# Altium schematic sheet 02 - MCU.SchDoc
size A3
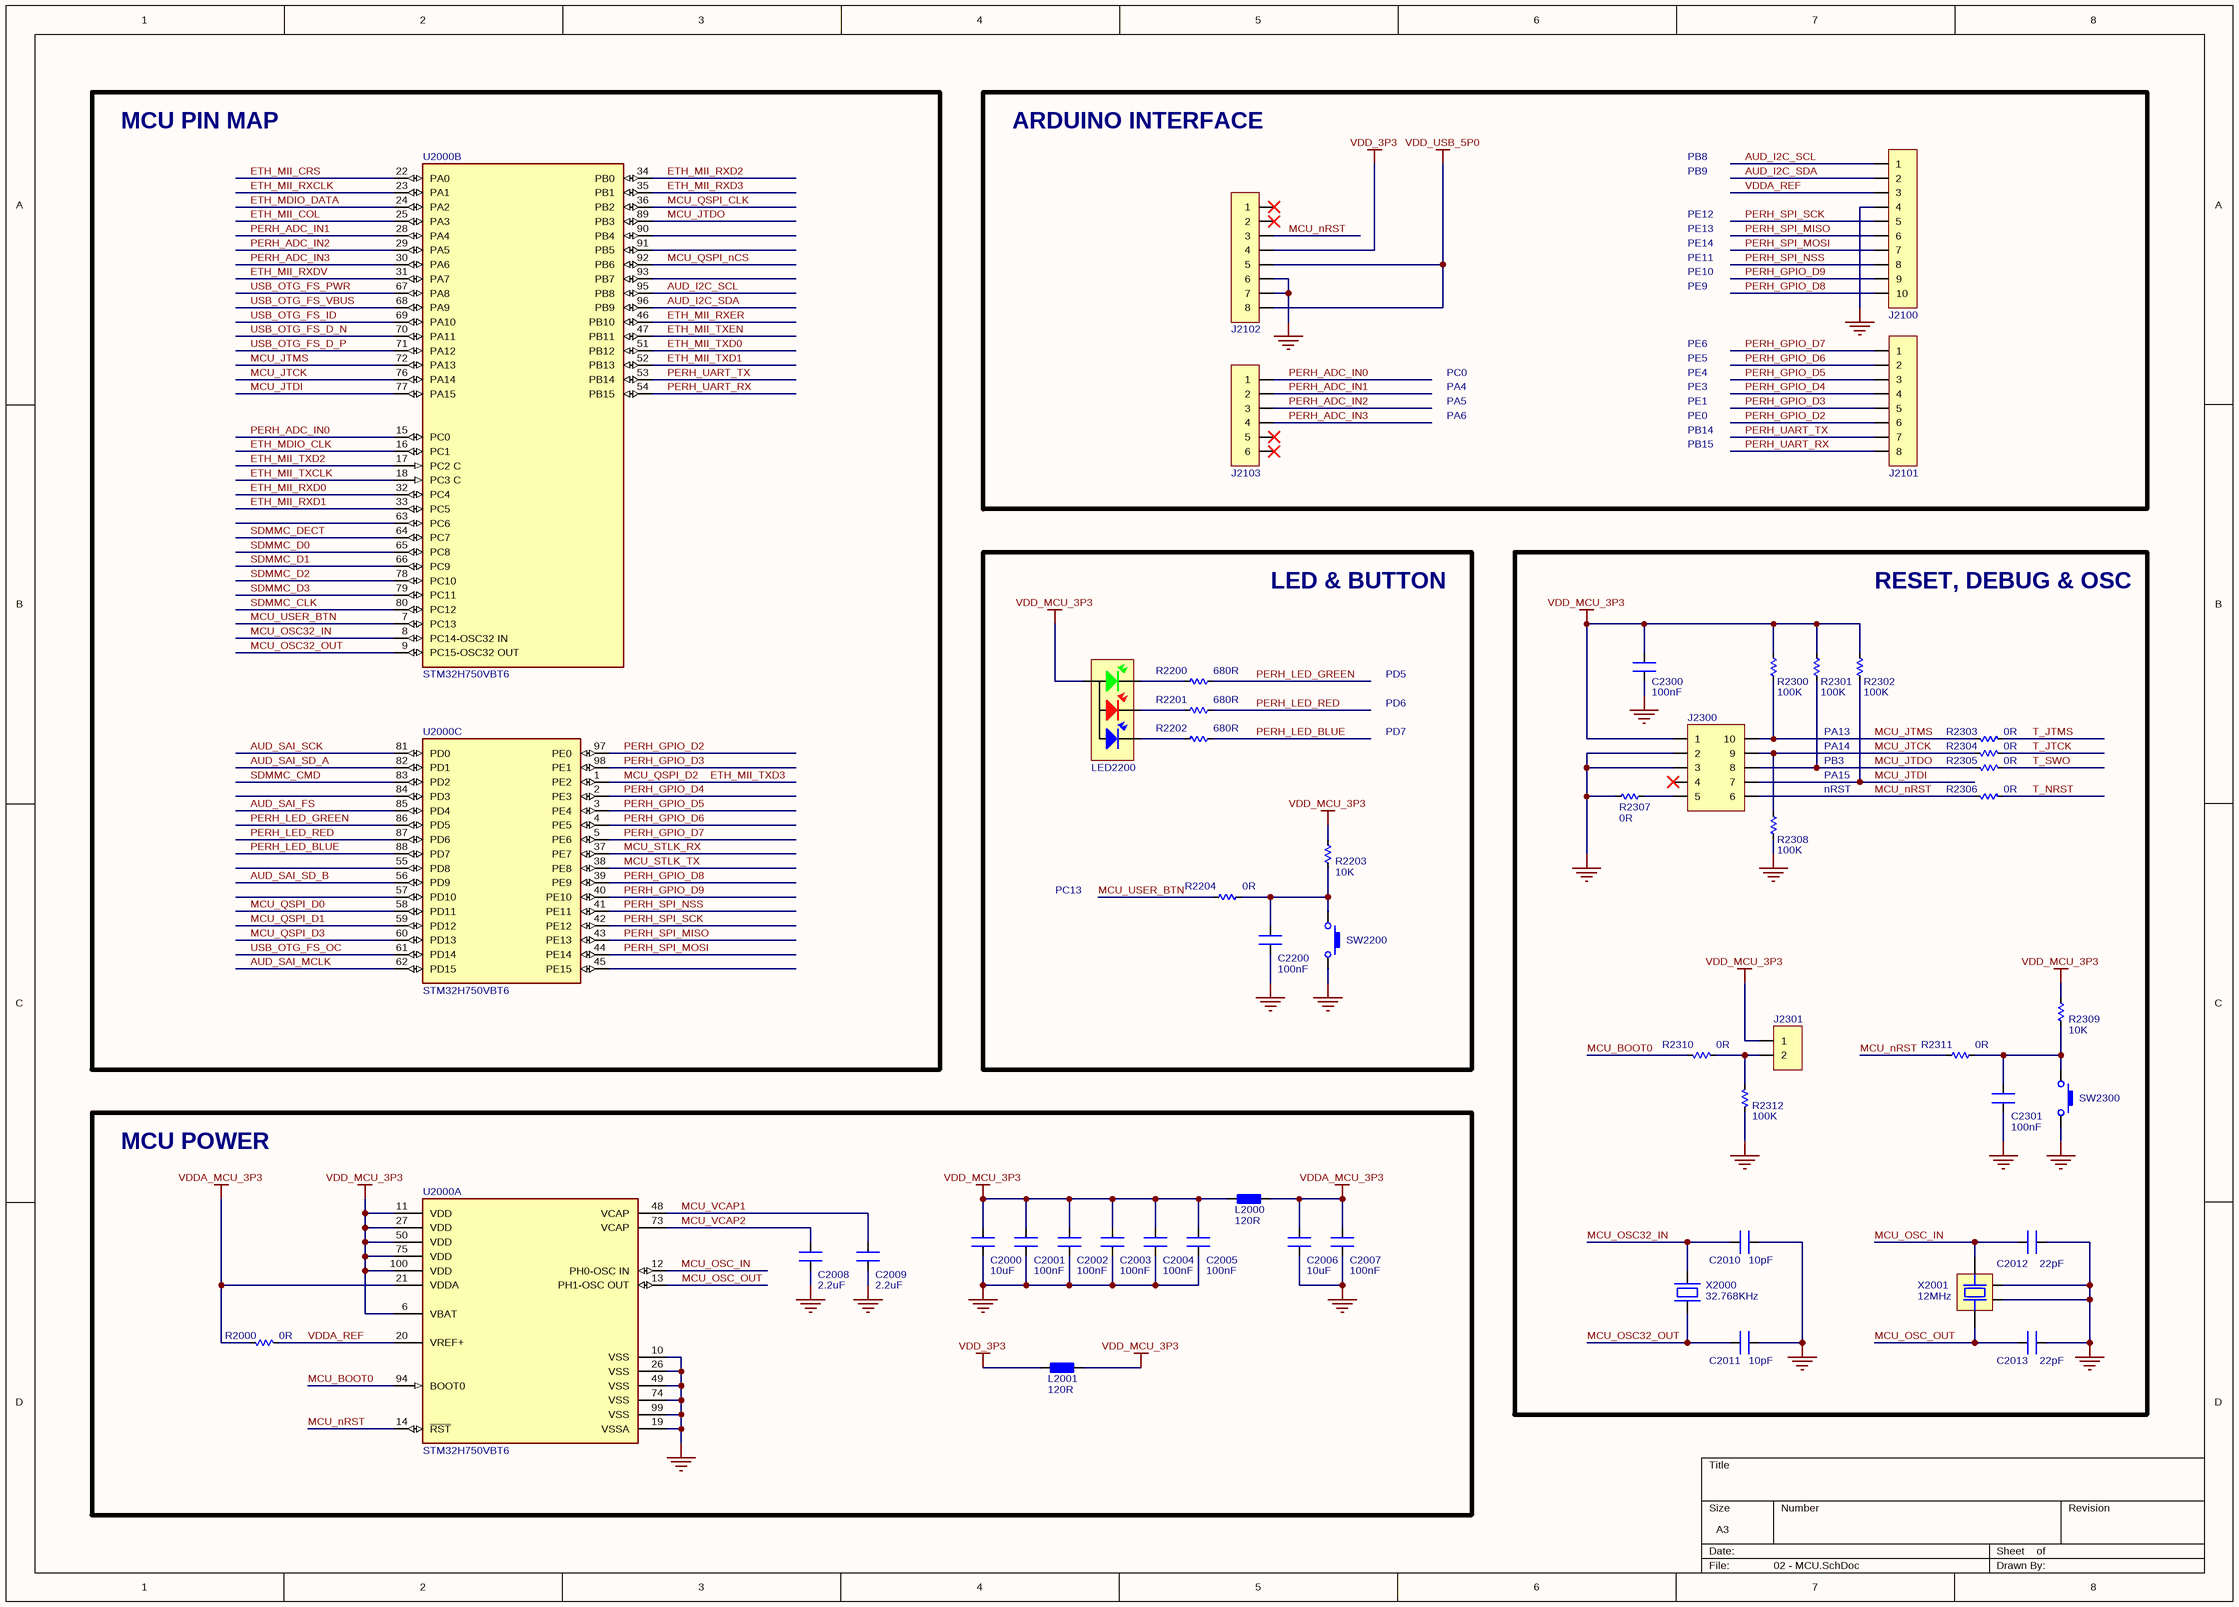
[diagram p0: 02 - MCU.SchDoc]

## Parts
C2000  value 10uF  [CN-SMD-0603]  (hidden comment: Capacitor)
C2001  value 100nF  [CN-SMD-0402]  (hidden comment: Capacitor)
C2002  value 100nF  [CN-SMD-0402]  (hidden comment: Capacitor)
C2003  value 100nF  [CN-SMD-0402]  (hidden comment: Capacitor)
C2004  value 100nF  [CN-SMD-0402]  (hidden comment: Capacitor)
C2005  value 100nF  [CN-SMD-0402]  (hidden comment: Capacitor)
C2006  value 10uF  [CN-SMD-0603]  (hidden comment: Capacitor)
C2007  value 100nF  [CN-SMD-0402]  (hidden comment: Capacitor)
C2008  value 2.2uF  [CN-SMD-0603]  (hidden comment: Capacitor)
C2009  value 2.2uF  [CN-SMD-0603]  (hidden comment: Capacitor)
C2010  value 10pF  [CN-SMD-0402]  (hidden comment: Capacitor)
C2011  value 10pF  [CN-SMD-0402]  (hidden comment: Capacitor)
C2012  value 22pF  [CN-SMD-0402]  (hidden comment: Capacitor)
C2013  value 22pF  [CN-SMD-0402]  (hidden comment: Capacitor)
C2200  value 100nF  [CN-SMD-0402]  (hidden comment: Capacitor)
C2300  value 100nF  [CN-SMD-0402]  (hidden comment: Capacitor)
C2301  value 100nF  [CN-SMD-0402]  (hidden comment: Capacitor)
J2100  Terminal strip  [JP10-C1T]  (value not drawn)
J2101  Terminal strip  [JP8-C1T]  (value not drawn)
J2102  Terminal strip  [JP8-C1T]  (value not drawn)
J2103  Terminal strip  [JP6-C1T]  (value not drawn)
J2300  Terminal strip  [JP1.27-10P]  (value not drawn)
J2301  JP2  [JP2-D1T]  (value not drawn)
L2000  value 120R  [L-SMD-0402]  (hidden comment: Ferrite bead)
L2001  value 120R  [L-SMD-0603]  (hidden comment: Ferrite bead)
LED2200  LED  [LED-SMD-3528-RGB]  (value not drawn)
R2000  value 0R  [RES-SMD-0402]  (hidden comment: Resistor)
R2200  value 680R  [RES-SMD-0402]  (hidden comment: Resistor)
R2201  value 680R  [RES-SMD-0402]  (hidden comment: Resistor)
R2202  value 680R  [RES-SMD-0402]  (hidden comment: Resistor)
R2203  value 10K  [RES-SMD-0402]  (hidden comment: Resistor)
R2204  value 0R  [RES-SMD-0402]  (hidden comment: Resistor)
R2300  value 100K  [RES-SMD-0402]  (hidden comment: Resistor)
R2301  value 100K  [RES-SMD-0402]  (hidden comment: Resistor)
R2302  value 100K  [RES-SMD-0402]  (hidden comment: Resistor)
R2303  value 0R  [RES-SMD-0402]  (hidden comment: Resistor)
R2304  value 0R  [RES-SMD-0402]  (hidden comment: Resistor)
R2305  value 0R  [RES-SMD-0402]  (hidden comment: Resistor)
R2306  value 0R  [RES-SMD-0402]  (hidden comment: Resistor)
R2307  value 0R  [RES-SMD-0402]  (hidden comment: Resistor)
R2308  value 100K  [RES-SMD-0402]  (hidden comment: Resistor)
R2309  value 10K  [RES-SMD-0402]  (hidden comment: Resistor)
R2310  value 0R  [RES-SMD-0402]  (hidden comment: Resistor)
R2311  value 0R  [RES-SMD-0402]  (hidden comment: Resistor)
R2312  value 100K  [RES-SMD-0402]  (hidden comment: Resistor)
SW2200  Switch  [SW2-SMD-3x4x2M]  (value not drawn)
SW2300  Switch  [SW2-SMD-3x4x2M]  (value not drawn)
U2000  STM32H750VBT6  [FP-LQFP100-1L-IPC_A]  (parts A,B,C of 3)
X2000  value 32.768KHz  [XT-SMD-FC-135]  (hidden comment: Crystal)
X2001  value 12MHz  [XT-SMD-3225-4P]  (hidden comment: Crystal)

## Blocks framed on the sheet
MCU PIN MAP: U2000
ARDUINO INTERFACE: J2100-J2103
LED & BUTTON: C2200 LED2200 R2200-R2204 SW2200
RESET, DEBUG & OSC: C2010-C2013 C2300 C2301 J2300 J2301 R2300-R2312 SW2300 X2000 X2001
MCU POWER: C2000-C2009 L2000 L2001 R2000 U2000

## Nets
GND: C2000.1 C2001.1 C2002.1 C2003.1 C2004.1 C2005.1 C2006.1 C2007.1 C2008.1 C2009.1 C2010.1 C2011.1 C2012.2 C2013.2 C2200.1 C2300.1 C2301.1 J2100.4 J2102.6 J2102.7 J2300.2 J2300.3 R2307.2 R2308.2 R2312.2 SW2200.2 SW2300.2 U2000.10(VSS) U2000.19(VSSA) U2000.26(VSS) U2000.49(VSS) U2000.74(VSS) U2000.99(VSS) X2001.2 X2001.4
VDD_3P3: J2102.4 L2001.2
VDD_MCU_3P3: C2000.2 C2001.2 C2002.2 C2003.2 C2004.2 C2005.2 C2300.2 J2300.1 J2301.1 L2000.2 L2001.1 LED2200.2(Common) R2203.1 R2300.1 R2301.1 R2302.1 R2309.1 U2000.6(VBAT) U2000.11(VDD) U2000.27(VDD) U2000.50(VDD) U2000.75(VDD) U2000.100(VDD)
VDD_USB_5P0: J2102.5 J2102.8
VDDA_MCU_3P3: C2006.2 C2007.2 L2000.1 R2000.2 U2000.21(VDDA)
AUD_I2C_SCL: J2100.1 U2000.95(PB8)
AUD_I2C_SDA: J2100.2 U2000.96(PB9)
AUD_SAI_FS: U2000.85(PD4)
AUD_SAI_MCLK: U2000.62(PD15)
AUD_SAI_SCK: U2000.81(PD0)
AUD_SAI_SD_A: U2000.82(PD1)
AUD_SAI_SD_B: U2000.56(PD9)
ETH_MDIO_CLK: U2000.16(PC1)
ETH_MDIO_DATA: U2000.24(PA2)
ETH_MII_COL: U2000.25(PA3)
ETH_MII_CRS: U2000.22(PA0)
ETH_MII_RXCLK: U2000.23(PA1)
ETH_MII_RXD0: U2000.32(PC4)
ETH_MII_RXD1: U2000.33(PC5)
ETH_MII_RXD2: U2000.34(PB0)
ETH_MII_RXD3: U2000.35(PB1)
ETH_MII_RXDV: U2000.31(PA7)
ETH_MII_RXER: U2000.46(PB10)
ETH_MII_TXCLK: U2000.18(PC3_C)
ETH_MII_TXD0: U2000.51(PB12)
ETH_MII_TXD1: U2000.52(PB13)
ETH_MII_TXD2: U2000.17(PC2_C)
ETH_MII_TXD3: U2000.1(PE2)  [also labelled MCU_QSPI_D2]
ETH_MII_TXEN: U2000.47(PB11)
MCU_BOOT0: R2310.2 U2000.94(BOOT0)
MCU_JTCK: J2300.9 R2304.2 R2308.1 U2000.76(PA14)
MCU_JTDI: J2300.7 R2302.2 U2000.77(PA15)
MCU_JTDO: J2300.8 R2301.2 R2305.2 U2000.89(PB3)
MCU_JTMS: J2300.10 R2300.2 R2303.2 U2000.72(PA13)
MCU_nRST: J2102.3 J2300.6 R2306.2 R2311.1 U2000.14(~{RST})
MCU_OSC32_IN: C2010.2 U2000.8(PC14-OSC32_IN) X2000.2
MCU_OSC32_OUT: C2011.2 U2000.9(PC15-OSC32_OUT) X2000.1
MCU_OSC_IN: C2012.1 U2000.12(PH0-OSC_IN) X2001.3
MCU_OSC_OUT: C2013.1 U2000.13(PH1-OSC_OUT) X2001.1
MCU_QSPI_CLK: U2000.36(PB2)
MCU_QSPI_D0: U2000.58(PD11)
MCU_QSPI_D1: U2000.59(PD12)
MCU_QSPI_D3: U2000.60(PD13)
MCU_QSPI_nCS: U2000.92(PB6)
MCU_STLK_RX: U2000.37(PE7)
MCU_STLK_TX: U2000.38(PE8)
MCU_USER_BTN: R2204.1 U2000.7(PC13)
MCU_VCAP1: C2009.2 U2000.48(VCAP)
MCU_VCAP2: C2008.2 U2000.73(VCAP)
PERH_ADC_IN0: J2103.1 U2000.15(PC0)
PERH_ADC_IN1: J2103.2 U2000.28(PA4)
PERH_ADC_IN2: J2103.3 U2000.29(PA5)
PERH_ADC_IN3: J2103.4 U2000.30(PA6)
PERH_GPIO_D2: J2101.6 U2000.97(PE0)
PERH_GPIO_D3: J2101.5 U2000.98(PE1)
PERH_GPIO_D4: J2101.4 U2000.2(PE3)
PERH_GPIO_D5: J2101.3 U2000.3(PE4)
PERH_GPIO_D6: J2101.2 U2000.4(PE5)
PERH_GPIO_D7: J2101.1 U2000.5(PE6)
PERH_GPIO_D8: J2100.10 U2000.39(PE9)
PERH_GPIO_D9: J2100.9 U2000.40(PE10)
PERH_LED_BLUE: R2202.2 U2000.88(PD7)
PERH_LED_GREEN: R2200.2 U2000.86(PD5)
PERH_LED_RED: R2201.2 U2000.87(PD6)
PERH_SPI_MISO: J2100.6 U2000.43(PE13)
PERH_SPI_MOSI: J2100.7 U2000.44(PE14)
PERH_SPI_NSS: J2100.8 U2000.41(PE11)
PERH_SPI_SCK: J2100.5 U2000.42(PE12)
PERH_UART_RX: J2101.8 U2000.54(PB15)
PERH_UART_TX: J2101.7 U2000.53(PB14)
SDMMC_CLK: U2000.80(PC12)
SDMMC_CMD: U2000.83(PD2)
SDMMC_D0: U2000.65(PC8)
SDMMC_D1: U2000.66(PC9)
SDMMC_D2: U2000.78(PC10)
SDMMC_D3: U2000.79(PC11)
SDMMC_DECT: U2000.64(PC7)
T_JTCK: R2304.1
T_JTMS: R2303.1
T_NRST: R2306.1
T_SWO: R2305.1
USB_OTG_FS_D_N: U2000.70(PA11)
USB_OTG_FS_D_P: U2000.71(PA12)
USB_OTG_FS_ID: U2000.69(PA10)
USB_OTG_FS_OC: U2000.61(PD14)
USB_OTG_FS_PWR: U2000.67(PA8)
USB_OTG_FS_VBUS: U2000.68(PA9)
VDDA_REF: J2100.3 R2000.1 U2000.20(VREF+)
NetC2200_2: C2200.2 R2203.2 R2204.2 SW2200.1
NetC2301_2: C2301.2 R2309.2 R2311.2 SW2300.1
NetJ2300_5: J2300.5 R2307.1
NetJ2301_2: J2301.2 R2310.1 R2312.1
NetLED2200_1: LED2200.1(Red_Cathode) R2201.1
NetLED2200_3: LED2200.3(Blue_Cathode) R2202.1
NetLED2200_4: LED2200.4(Green_Cathode) R2200.1

Not connected (* = marked no-connect by the designer): J2102 1* 2*; J2103 5* 6*; J2300 4*; U2000 45(PE15) 55(PD8) 57(PD10) 63(PC6) 84(PD3) 90(PB4) 91(PB5) 93(PB7)

## Notes on the sheet
- PB8
- PB9
- PE12
- PE13
- PE14
- PE11
- PE9
- PE10
- PC0
- PA4
- PA5
- PE1
- PE3
- PE4
- PE5
- PE6
- PA6
- PB14
- PB15
- PE0
- PD5
- PD6
- PD7
- PA13
- PA14
- PB3
- PA15
- nRST
- PC13

## Library data of the parts
C2000 C2006 = Cap: Ceramic Capacitor SMD 0603 10uF ±20% 10V
C2001-C2005 C2007 C2200 C2300 C2301 = Cap: Ceramic Capacitor SMD 0402 100nF ±20% 16V
C2008 C2009 = Cap: Ceramic Capacitor SMD 0603 2.2uF ±20% 16V
C2010 C2011 = Cap: Ceramic Capacitor SMD 0402 10pF ±20% 50V
C2012 C2013 = Cap: Ceramic Capacitor SMD 0402 22pF ±20% 50V
J2100 = JP10: Terminal strip 10-pin 1-row pitch 0.1" (2.54mm) DIP straight
J2101 J2102 = JP8: Terminal strip 8-pin 1-row pitch 0.1" (2.54mm) DIP straight
J2103 = JP6: Terminal strip 6-pin 1-row pitch 0.1" (2.54mm) DIP straight
J2300 = JP5x2: Terminal strip 5-pin 2-row pitch 0.05" (1.27mm) SMD straight
J2301 = JP2: Single 2-pin jumper
L2000 = Ferrite bead: Ferrite bead SMD 0402 120 Ohm @100MHz
L2001 = Ferrite bead: Ferrite bead SMD 0603 120 Ohm @100MHz
LED2200 = LED RGB CA: LED RGB Common Anode SMD-3528
R2000 R2204 R2303-R2307 R2310 R2311 = Res: Resistor SMD 0402 0R 1% 0.063W
R2200-R2202 = Res: Resistor SMD 0402 680R 1% 0.063W
R2203 R2309 = Res: Resistor SMD 0402 10K 1% 0.063W
R2300-R2302 R2308 R2312 = Res: Resistor SMD 0402 100K 1% 0.063W
SW2200 SW2300 = SW2: Tackle Switch 2-pin SMD 3x4x2mm
U2000 = CMP-12105-000017-1: 32-bit Arm® Cortex®-M7 480MHz MCUs, 128 Kbyte Flash, 1 Mbyte RAM, 46 com. and analog interfaces, crypto; Manufacturer: STMicroelectronics; Number Of Uart Channels: 9; Number Of I/Os: 82; Max Junction Temp: +125°C; Data Bus Width: 32bits; Ram Size: 1MBytes; Min Supply Voltage: 1.62V; Number Of Spi Channels: 6; Number Of Adc Channels: 36; Max Supply Voltage: 3.6V; Standoff Height: 0.05mm; Interface: I2C,SPI,UART,USART,CAN,USB,LIN,IrDA,Ethernet,I2S,Other; Number Of A/D Converters: 3; Number Of I2C Channels: 4; Memory Size: 128KBytes; Number Of Timers/Counters: 20; Number Of Ethernet Channels: 1; Core Architecture: ARM Cortex-M7; Number Of Usb Channels: 2; Number Of Pwm Channels: 42; Ambient Temperature Range High: +85°C; Temperature: -40°C to +125°C; ComponentLink2URL: https://www.st.com/resource/en/datasheet/stm32h750vb.pdf; Device Class L2: Embedded Processors and Controllers; Temperature Range Low: -40°C; Octopart: https://octopart.com/stm32h750vbt6-stmicroelectronics-94048547; Category: IC; Manufacturer Part Number: STM32H750VBT6; Height: 1.6mm; Lead Free: Yes; Device Class L1: Integrated Circuits (ICs); Digikey Description: IC MCU 32BIT 128KB FLASH 100LQFP; RoHS: TRUE; Ambient Temperature Range Low: -40°C; Device Class L3: Microcontrollers; ComponentLink2Description: Datasheet; Frequency: 480MHz; Mouser Description: MCU 32-Bit STM32H750VB ARM Cortex M7 RISC 128KB Flash 1.8V/2.5V/3.3V 100-Pin LQFP Tray; Number Of Cores: 1; Automotive: No; Memory Type: FLASH; Package: LQFP100-1L; Temperature Range High: +125°C
X2000 = XT2: Crystal Oscillator FC-135 32.768KHz 2-pin
X2001 = XT4: Crystal Oscillator SMD-3225 12MHz 4-pin